# EAGLE design picopew (EAGLE 7.5.0)
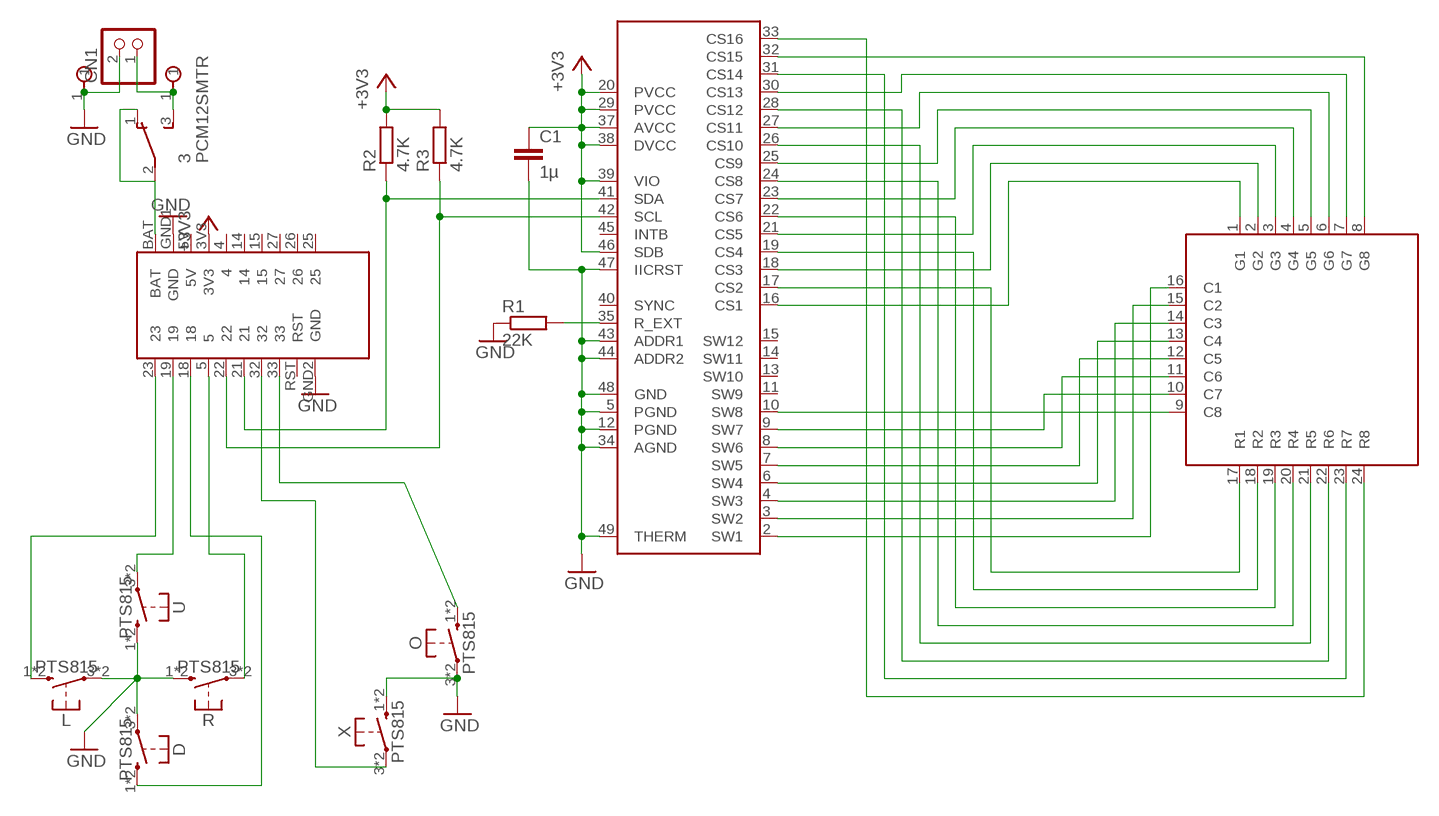
[diagram p0: schematic, sheet 1]

## Parts
1  KYX-788AHG  [KYX-788AHG]
2  TINYPICO  [TINYPICO]
3  PCM12SMTR  [MICROSLIDESWITCH]
4  SINGLEPAD  [SINGLEPAD]
5  SINGLEPAD  [SINGLEPAD]
C1  1µ  C-EUC0805  [C0805]
CN1  JST_2PIN-SMT-RA  [JST-PH-2-SMT-RA]
D  PTS815  [MICROPUSHBUTTON]
L  PTS815  [MICROPUSHBUTTON]
O  PTS815  [MICROPUSHBUTTON]
R  PTS815  [MICROPUSHBUTTON]
R1  22K  R-EU_R0805  [R0805]
R2  4.7K  R-EU_R0805  [R0805]
R3  4.7K  R-EU_R0805  [R0805]
U  PTS815  [MICROPUSHBUTTON]
U1  IS31FL3733-TQLS4  [TQFP48]
X  PTS815  [MICROPUSHBUTTON]

## Nets
+3V3: 2.3V3 C1.1 R2.2 R3.2 U1.20(PVCC) U1.29(PVCC) U1.37(AVCC) U1.38(DVCC) U1.39(VIO) U1.46(SDB)
GND: 2.GND1(GND) 2.GND2(GND) 5.1 C1.2 CN1.2 D.3(P) D.4(P) L.3(P) L.4(P) O.3(P) O.4(P) R1.1 R.1(S) R.2(S) U1.5(PGND) U1.12(PGND) U1.34(AGND) U1.43(ADDR1) U1.44(ADDR2) U1.47(IICRST) U1.48(GND) U1.49(THERM) U.1(S) U.2(S) X.1(S) X.2(S)
N$1: 1.16(C1) U1.2(SW1)
N$2: 1.15(C2) U1.3(SW2)
N$3: 1.14(C3) U1.4(SW3)
N$4: 1.13(C4) U1.6(SW4)
N$5: 1.12(C5) U1.7(SW5)
N$6: 1.11(C6) U1.8(SW6)
N$7: 1.10(C7) U1.9(SW7)
N$8: 1.9(C8) U1.10(SW8)
N$9: 1.1(G1) U1.16(CS1)
N$10: 1.17(R1) U1.17(CS2)
N$11: 1.2(G2) U1.18(CS3)
N$12: 1.18(R2) U1.19(CS4)
N$13: 1.3(G3) U1.21(CS5)
N$14: 1.19(R3) U1.22(CS6)
N$15: 1.4(G4) U1.23(CS7)
N$16: 1.20(R4) U1.24(CS8)
N$17: 1.5(G5) U1.25(CS9)
N$18: 1.21(R5) U1.26(CS10)
N$19: 1.6(G6) U1.27(CS11)
N$20: 1.22(R6) U1.28(CS12)
N$21: 1.7(G7) U1.30(CS13)
N$22: 1.23(R7) U1.31(CS14)
N$23: 1.8(G8) U1.32(CS15)
N$24: 1.24(R8) U1.33(CS16)
N$25: 2.21 R2.1 U1.41(SDA)
N$26: 2.22 R3.1 U1.42(SCL)
N$27: R1.2 U1.35(R_EXT)
N$28: 2.33 O.1(S) O.2(S)
N$29: 2.32 X.3(P) X.4(P)
N$30: 2.BAT 3.1(O) 3.2(P)
N$31: 3.3(S) 4.1 CN1.1
N$33: 2.5 R.3(P) R.4(P)
N$34: 2.18 D.1(S) D.2(S)
N$35: 2.19 U.3(P) U.4(P)
N$36: 2.23 L.1(S) L.2(S)
Unconnected: 2.4 2.14 2.15 2.25 2.26 2.27 2.RST U1.11(SW9) U1.13(SW10) U1.14(SW11) U1.15(SW12) U1.40(SYNC) U1.45(INTB)

## Power pins joined to a net without a drawn wire
5V: 2.5V

## Library data of the parts
1 = cwpackage:KYX-788AHG: 20mm bi-color LED matrix
2 = cwpackage:TINYPICO: TinyPICO
3 = cwpackage:PCM12SMTR: Ultraminiature Surface Mount Slide Switch
4 5 = cwpackage:SINGLEPAD: Single unlabeled through-hole pad
C1 = resistor:C-EU: CAPACITOR, European symbol
CN1 = cwpackage:JST_2PIN: JST 2-Pin Connectors of various flavors SMT-RA (S2B-PH-SM4) 4UConnector #17311
D L O R U X = cwpackage:PTS815: Tactile Switch Microminiature SMT
R1-R3 = resistor:R-EU_: RESISTOR, European symbol
U1 = cwpackage:IS31FL3733: 12×16 Dots Matrix LED Driver with individual auto breath function

## Board
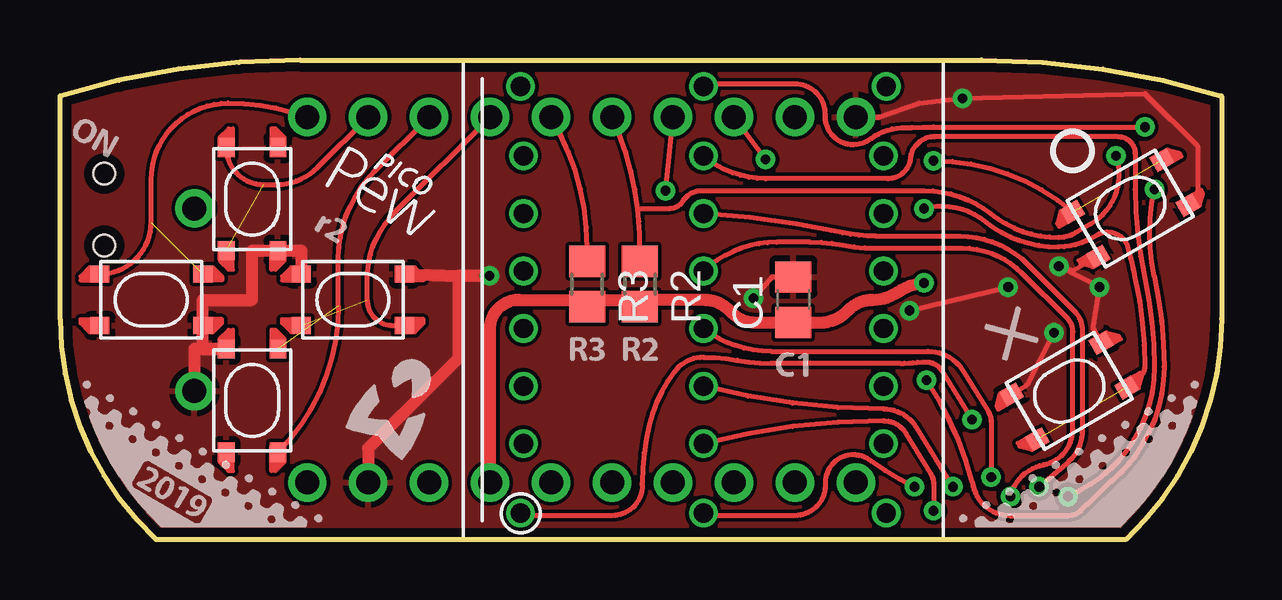
[diagram p1: board, top side]
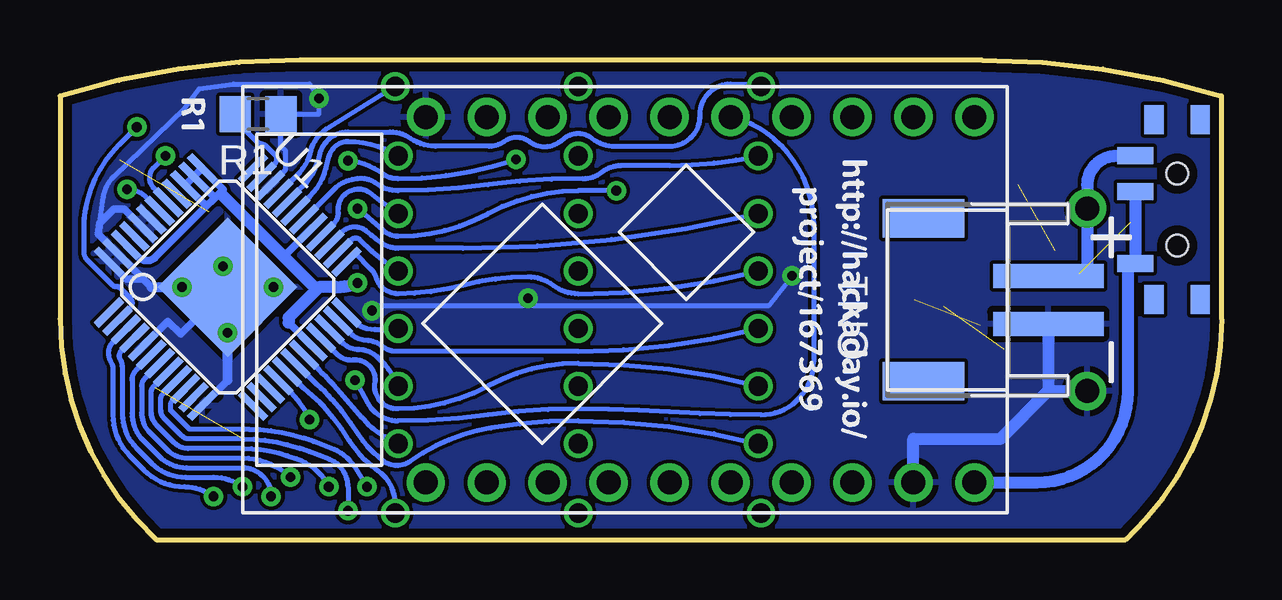
[diagram p2: board, bottom side, seen from below]

Size 48.4 x 20 mm. Coordinates in mm from the lower left corner, seen from the top.
Outline: 0,9.2 0,18.5 arc-17 10,20 38.4,20 arc-17 48.4,18.5 48.4,9.2 arc-47 44.4,0 4,0 arc-47 0,9.2
Copper layers (1*16): Top 0.035559375mm / dielectric 1.6mm / Bottom 0.035559375mm
Design rules "oshpark-2layer *": minimum track width 6mil, minimum drill 10mil, track to track 6mil, track to pad 6mil, pad to pad 6mil, via to via 6mil, smd to smd 0mil, copper to edge 15mil, drill to drill 6mil, minimum pad ring 5mil, minimum via ring 5mil, stop-mask expansion 2.5mil, vias tented up to drill 25mil, thermal gap 10mil

### Footprints (pad centres in the part's own frame; a part is rotated, then mirrored left to right if it is on the bottom)
KYX-788AHG = drill 0.8 pad 1.1: 1 -7.62,-8.9; 2 -7.5,-6; 3 -7.5,-3.6; 4 -7.5,-1.2; 5 -7.5,1.2; 6 -7.5,3.6; 7 -7.5,6; 8 -7.62,8.9; 9 0,-8.9; 10 0,-6; 11 0,-3.6; 12 0,-1.2; 13 0,1.2; 14 0,3.6; 15 0,6; 16 0,8.9; 17 7.62,-8.9; 18 7.5,-6; 19 7.5,-3.6; 20 7.5,-1.2; 21 7.5,1.2; 22 7.5,3.6; 23 7.5,6; 24 7.62,8.9
TINYPICO = drill 1 pad 1.6: 3V3 7.62,15.24; 4 10.16,15.24; 5 7.62,0; 5V 5.08,15.24; 14 12.7,15.24; 15 15.24,15.24; 18 5.08,0; 19 2.54,0; 21 12.7,0; 22 10.16,0; 23 0,0; 25 22.86,15.24; 26 20.32,15.24; 27 17.78,15.24; 32 15.24,0; 33 17.78,0; BAT 0,15.24; GND1 2.54,15.24; GND2 22.86,0; RST 20.32,0
MICROSLIDESWITCH = smd 0.7 x 1.5: 1 -2.25,1.75; 2 0.75,1.75; 3 2.25,1.75 | smd 1.2 x 0.8: CASE@1 -3.75,0.965; CASE@2 3.75,0.965; CASE@3 -3.75,-0.965; CASE@4 3.75,-0.965 | hole 0.9: -1.5,0; 1.5,0
SINGLEPAD = drill 1 pad 1.6: 1 0,0
C0805 = smd 1.3 x 1.5: 1 -0.95,0; 2 0.95,0
JST-PH-2-SMT-RA = smd 1 x 4.6: 1 1,-3.7; 2 -1,-3.7 | smd 1.6 x 3.4: NC1 -3.4,1.5; NC2 3.4,1.5
MICROPUSHBUTTON = smd 0.8 x 0.7: 1 -2.15,1.075; 2 2.15,1.075; 3 -2.15,-1.075; 4 2.15,-1.075
R0805 = smd 1.3 x 1.5: 1 -0.95,0; 2 0.95,0
TQFP48 = smd 0.3 x 1.5: 1 -2.75,-4.25; 2 -2.25,-4.25; 3 -1.75,-4.25; 4 -1.25,-4.25; 5 -0.75,-4.25; 6 -0.25,-4.25; 7 0.25,-4.25; 8 0.75,-4.25; 9 1.25,-4.25; 10 1.75,-4.25; 11 2.25,-4.25; 12 2.75,-4.25; 25 2.75,4.25; 26 2.25,4.25; 27 1.75,4.25; 28 1.25,4.25; 29 0.75,4.25; 30 0.25,4.25; 31 -0.25,4.25; 32 -0.75,4.25; 33 -1.25,4.25; 34 -1.75,4.25; 35 -2.25,4.25; 36 -2.75,4.25 | smd 1.5 x 0.3: 13 4.25,-2.75; 14 4.25,-2.25; 15 4.25,-1.75; 16 4.25,-1.25; 17 4.25,-0.75; 18 4.25,-0.25; 19 4.25,0.25; 20 4.25,0.75; 21 4.25,1.25; 22 4.25,1.75; 23 4.25,2.25; 24 4.25,2.75; 37 -4.25,2.75; 38 -4.25,2.25; 39 -4.25,1.75; 40 -4.25,1.25; 41 -4.25,0.75; 42 -4.25,0.25; 43 -4.25,-0.25; 44 -4.25,-0.75; 45 -4.25,-1.25; 46 -4.25,-1.75; 47 -4.25,-2.25; 48 -4.25,-2.75 | smd 4.11 x 4.11: 49 0,0

### Placement (x,y rotation side)
1  26.81,10 0 top
2  10.3,17.62 180 bottom
3  1.85,13.76 90 bottom
4  5.6,13.81 0 top
5  5.6,6.19 0 top
C1  30.56,10 90 top
CN1  10.92,10 90 bottom
D  8,5.8 270 top
L  3.81,10 0 top
O  44.59,13.81 30 top
R  12.21,10 0 top
R1  40.15,17.75 180 bottom
R2  24.16,10.66 270 top
R3  21.96,10.66 270 top
U  8,14.2 270 top
U1  41.41,10.53 315 bottom
U$1  [PICOPEW-O]  42.19,16.21 30 top
U$2  [PICOPEW-CORNER-L]  0,0 0 top
U$3  [PICOPEW-X]  39.65,8.59 30 top
U$4  [PLUS]  4.6,12.6 270 bottom
U$5  [PICOPEW]  13,13.6 330 top
U$6  [CHAR114]  10.54,12.92 330 top
U$7  [CWLOGO-4]  14,5.6 330 top
U$8  [PICOPEW-CORNER-R]  48.4,0 0 top
U$9  [CHAR050]  10.98,12.67 330 top
U$10  [CHAR079]  0.36,16.84 330 top
U$11  [CHAR078]  1.24,16.34 330 top
U$12  [MINUS]  4.6,7.4 270 bottom
U$14  [CHAR082]  43.35,18.45 270 bottom
U$15  [CHAR050]  3.15,2.3 330 top
U$16  [CHAR048]  3.81,1.92 330 top
U$17  [CHAR049]  4.47,1.54 330 top
U$18  [CHAR057]  5.13,1.15 330 top
U$19  [CHAR049]  43.35,17.62 270 bottom
U$20  [CHAR082]  23.4,7.45 0 top
U$21  [CHAR050]  24.23,7.45 0 top
U$22  [CHAR082]  21.19,7.45 0 top
U$23  [CHAR051]  22.02,7.45 0 top
U$24  [CHAR067]  29.82,6.8 0 top
U$25  [CHAR049]  30.66,6.8 0 top
U$26  [CHAR049]  17.6,9.92 270 bottom
U$27  [CHAR054]  17.6,9.15 270 bottom
U$28  [CHAR055]  17.6,8.39 270 bottom
U$29  [CHAR051]  17.6,7.62 270 bottom
U$30  [CHAR054]  17.6,6.86 270 bottom
U$31  [CHAR057]  17.6,6.09 270 bottom
U$52  [CHAR104]  15.8,15.85 270 bottom
U$53  [CHAR116]  15.8,15.04 270 bottom
U$54  [CHAR116]  15.8,14.55 270 bottom
U$55  [CHAR112]  15.8,14.06 270 bottom
U$56  [CHAR058]  15.8,13.22 270 bottom
U$57  [CHAR047]  15.8,12.89 270 bottom
U$58  [CHAR047]  15.8,12.46 270 bottom
U$59  [CHAR104]  15.8,12.02 270 bottom
U$60  [CHAR097]  15.8,11.21 270 bottom
U$61  [CHAR099]  15.8,10.48 270 bottom
U$62  [CHAR107]  15.8,9.87 270 bottom
U$63  [CHAR097]  15.8,9.12 270 bottom
U$64  [CHAR100]  15.8,8.39 270 bottom
U$65  [CHAR097]  15.8,7.56 270 bottom
U$66  [CHAR121]  15.8,6.84 270 bottom
U$67  [CHAR046]  15.8,6.12 270 bottom
U$68  [CHAR105]  15.8,5.79 270 bottom
U$69  [CHAR111]  15.8,5.43 270 bottom
U$70  [CHAR047]  15.8,4.63 270 bottom
U$71  [CHAR112]  17.6,14.7 270 bottom
U$72  [CHAR114]  17.6,13.87 270 bottom
U$73  [CHAR111]  17.6,13.36 270 bottom
U$74  [CHAR106]  17.6,12.56 270 bottom
U$75  [CHAR101]  17.6,12.18 270 bottom
U$76  [CHAR099]  17.6,11.46 270 bottom
U$77  [CHAR116]  17.6,10.84 270 bottom
U$78  [CHAR047]  17.6,10.35 270 bottom
X  42.05,6.19 30 top

### Tracks (layer width: path | path; a pad name or v marks a point on that pad's centre or on a via)
+3V3  (via drill 0.4 pad 0.81)
  Top 0.203: R3.2 21.96,10 | 24.16,10 R2.2
  Top 0.508: 2.3V3 17.92,8.8 arc-90 19.12,10 21.96,10 24.16,10 26.87,10 arc-45 27.86,9.59 27.99,9.46 arc45 28.98,9.05 C1.1 31.57,9.05 arc45 32.74,9.46 32.87,9.59 arc-45 33.86,10 arc33 34.9,10.31 arc-28 v36,10.7
  Bottom 0.305: 38.88,9.05 U1.20 | U1.29 39.08,11.8 | U1.46 45.13,11.77 arc-90 44.43,11.77 42.3,13.9 | 42.3,13.9 42,14.2 | 42,14.2 41.7,14.5 | 41.7,14.5 41.61,14.59 41.6,14.59 U1.37 U1.39 42.31,13.9 42.3,13.9 | U1.38 42,14.3 42,14.2 | 41.6,14.32 41.7,14.5
  Bottom 0.508: 37.7,10.43 38.88,9.26 38.88,9.05 | 37.7,10.43 39.08,11.8 41.6,14.32 | v36,10.7 arc22 36.87,10.53 37.61,10.53 37.7,10.43
GND  (via drill 0.4 pad 0.81)
  Top 0.203: O.3 42.2,11.2 v41.62,11.4 v43.32,10.53 43.05,8.85 X.2 | v35.4,9.55 v39.51,10.53 | 2.GND2 34.11,17.62 35.8,18.2 v37.6,18.4 45.2,18.6 47.4,16.4 47.4,14.37 O.4 | X.1 40.3,6.45 v41.41,8.62 | C1.2 29.66,10.95 v28.9,10.07
  Top 0.508: v17.9,11 16.6,11 | 16.6,11 16.6,7.56 12.84,3.8 2.GND1 | R.2 16.6,11 | 5.1 5.6,7.95 D.3 5.96,7.95 L.4 5.96,10 8,10 8,12.05 U.2 10.05,12.05 R.1
  Bottom 0.203: 43.89,10.53 U1.49 | 42.48,10.53 U1.49 | 41.77,10.53 U1.49 | v41.62,11.4 U1.49 | v17.9,11 18.87,9.75 28.7,9.75 v28.9,10.07 29.1,9.75 35.2,9.75 v35.4,9.55 | v39.51,10.53 U1.49 | v43.32,10.53 U1.49 | U1.34 39,15.42 39,16.2 39.2,16.39 R1.1 37.6,17.75 v37.6,18.4 38,19 41.18,19 42.6,18.8 43.2,18 46.15,15.15 arc-38 46.59,14.27 46.74,13.19
  Bottom 0.305: U1.12 41.41,6.64 | v41.41,8.62 U1.49 43.37,8.57 43.9,9.1 U1.5 | 44.93,10.87 U1.47 46.8,12.73 46.74,13.19 46.15,13.78 45.73,13.78 U1.44 | 44.93,10.87 44.6,10.53 | U1.48 45.64,10.87 44.93,10.87
  Bottom 0.406: 41.41,6.64 U1.49 44.6,10.53
  Bottom 0.508: 2.GND1 12.84,4.2 9.2,4.2 7.22,6.19 | CN1.2 7.22,6.19 | 7.22,6.19 5.1
  pour Bottom: 10,19.94 38.4,19.94 arc-17 48.6,18.5 48.6,9.2 arc-47 44.4,-0.06 4,-0.06 arc-47 -0.2,9.2 -0.2,18.5 arc-17
  pour Top: 48.6,18.5 48.6,9.2 arc-47 44.4,-0.06 4,-0.06 arc-47 -0.1,9.2 -0.1,18.5 arc-17 10,20.04 38.4,20.04 arc-17
N$1  (via drill 0.4 pad 0.81)
  Top 0.203: v45.2,17.2 36.4,17.2 arc3 35.06,17.17 arc33 33.79,16.73 33.72,16.68 arc-125 31.89,17.62 31.89,17.73 arc90 30.62,19 27.06,19 1.16
  Bottom 0.203: U1.2 45.48,9.65 arc-90 45.48,10.08 45.9,10.5 | 46.2,10.6 47.28,11.68 arc45 47.4,11.97 47.4,12.93 arc45 45.94,16.46 v45.2,17.2 | 45.9,10.5 46.05,10.55 | 46.05,10.55 46.2,10.6 | 45.9,10.5 arc-53 46.05,10.55 | 46.05,10.55 arc53 46.2,10.6
N$2  (via drill 0.4 pad 0.81)
  Top 0.203: 1.15 arc40 29.4,15.05 34.5,15.05 arc85 35.43,15.89 arc-85 36.43,16.8 44.1,16.8 arc-90 44.8,16.1 44.8,14.6 arc12 45.2,10.9 arc-12 45.6,7.2 arc-67 v42,1.8
  Bottom 0.203: U1.3 46.2,8.22 arc-48 46.37,7.78 arc-28 46.23,7.32 arc31 46.2,7.2 46.2,5.19 arc-45 45.5,3.5 44.9,2.9 arc-45 43.21,2.2 arc37 v42,1.8
N$3  (via drill 0.4 pad 0.81)
  Top 0.203: 1.14 1.14 arc-9 32.6,12.8 arc12 34,12.65 37.49,12.65 arc-45 40.32,11.48 42.25,9.55 arc-45 42.6,8.7 42.6,4.6 arc-50 41.92,3.14 v40.8,2.2
  Bottom 0.203: U1.4 45.85,7.86 arc-76 45.89,7.53 arc31 45.8,7.2 45.8,5.23 arc-45 45.21,3.81 44.59,3.19 arc-45 43.17,2.6 42,2.6 arc37 v40.8,2.2
N$4  (via drill 0.4 pad 0.81)
  Top 0.203: 1.13 arc-43 29.86,12.4 31.26,12.4 arc-10 32.63,12.28 arc10 34,12.15 37.6,12.15 arc-45 40.08,11.12 41.97,9.23 arc-45 42.2,8.67 42.2,4.6 arc-79 40.99,3.12 arc65 v39.6,1.8
  Bottom 0.203: U1.6 45.22,7.07 arc-45 45.4,6.65 45.4,5.26 arc-45 44.93,4.13 44.27,3.47 arc-45 43.14,3 40.8,3 arc90 v39.6,1.8
N$5  (via drill 0.4 pad 0.81)
  Top 0.203: v38.8,2.6 38.8,4.92 arc32 38.69,5.31 37.62,7.04 arc58 36.17,7.85 29.63,7.85 arc-37 1.12
  Bottom 0.203: U1.7 44.87,6.72 arc-45 45,6.41 45,5.3 arc-45 44.65,4.45 43.95,3.75 arc-45 43.1,3.4 40.8,3.4 arc44 v38.8,2.6
N$6  (via drill 0.4 pad 0.81)
  Top 0.203: 1.11 arc14 34.31,5.45 arc-58 35.67,4.69 v37.2,2.2
  Bottom 0.203: U1.8 44.51,6.37 arc-45 44.6,6.16 44.6,5.33 arc-45 44.37,4.77 43.63,4.03 arc-45 43.07,3.8 40.8,3.8 arc18 38.93,3.5 38.54,3.37 arc45 v37.2,2.2
N$7  (via drill 0.4 pad 0.81)
  Top 0.203: 1.10 arc-14 34.31,4.95 34.32,4.95 arc-59 35.25,4.43 36.28,2.74 arc-31 36.4,2.32 v36.4,1.2
  Bottom 0.203: U1.9 44.16,6.02 arc-45 44.2,5.92 44.2,5.37 arc-45 44.08,5.08 43.32,4.32 arc-45 43.03,4.2 40.8,4.2 arc18 38.46,3.82 | 38.46,3.82 38.4,3.8 | v36.4,1.2 36.4,2.2 arc-68 37.17,3.34 arc-4 38.46,3.82
N$8  (via drill 0.4 pad 0.81)
  Top 0.203: 1.9 27.06,1 30.62,1 arc90 31.89,2.27 31.89,2.38 arc-125 33.72,3.32 33.79,3.27 arc9 v35.6,2.2
  Bottom 0.203: U1.10 43.8,5.67 43.8,5.4 43,4.6 40.53,4.6 arc18 38.26,4.23 arc4 37,3.77 arc36 36.12,3.03 v35.6,2.2
N$9  (via drill 0.4 pad 0.81)
  Top 0.203: 1.1 19.44,1 23,1 arc90 24.27,2.27 24.27,2.38 arc-13 24.56,4.8 arc-24 25.6,7 arc-53 26.81,7.6 arc-10 28.22,7.47 arc10 29.63,7.35 35,7.35 arc5 35.55,7.38 arc-5 36.1,7.4 arc-58 36.74,7.04 v38,5
  Bottom 0.203: U1.16 38.8,6.15 arc20 v38,5
N$10
  Bottom 0.203: U1.17 38.4,6.45 arc-7 37.89,6 arc11 37.39,5.53 arc8 36.34,4.12 arc-22 35.13,2.85 arc54 34.43,1.48 1.17
N$11
  Bottom 0.203: U1.18 38,6.76 arc-3 37.52,6.3 arc7 37.05,5.83 arc8 35.95,4.37 arc-22 34.87,3.23 arc-66 33.79,3.27 arc26 30.43,4.65 arc9 26.81,4.95 arc14 1.2
N$12
  Bottom 0.203: U1.19 37.6,7.07 arc1 37.15,6.6 arc3 36.71,6.12 35.8,5.08 arc-26 1.18
N$13
  Bottom 0.203: U1.21 36.82,7.7 arc-52 36.2,7.48 arc46 35.56,7.29 arc58 35.28,6.55 35.28,6.54 arc-98 34.34,5.45 34.31,5.45 arc-28 30.56,6.4 arc28 26.81,7.35 arc14 1.3
N$14
  Bottom 0.203: U1.22 36.61,8.2 arc-45 35.94,7.92 arc39 35.25,7.67 arc27 1.19
N$15
  Bottom 0.203: U1.23 36.3,8.6 arc-43 35.63,8.3 arc37 34.94,8.04 arc-40 34.42,7.85 26.81,7.85 arc-14 1.4
N$16
  Bottom 0.203: U1.24 36,9 arc-36 35.6,8.8 arc-17 1.20
N$17
  Bottom 0.203: 36.16,11.9 U1.25 36.11,11.95 35.43,11.27 arc29 35.23,10.93 arc-74 34.32,10.25 34.31,10.25 arc-15 31.61,10.6 arc15 28.9,10.95 arc37 27.86,10.6 arc-37 26.81,10.25 arc-14 1.5
N$18
  Bottom 0.203: U1.26 36.26,12.51 arc90 35.91,12.51 arc-11 1.21
N$19
  Bottom 0.203: U1.27 36.65,12.82 arc86 35.63,12.86 arc-5 35.03,12.38 arc-36 34.31,12.15 31.6,12.15 arc-13 1.6
N$20
  Bottom 0.203: U1.28 36.98,13.2 arc-45 36.8,13.63 36.8,13.8 arc79 36.16,14.58 | 36.16,14.58 | 36.16,14.58 36.09,14.6 arc49 35.49,14.46 arc-3 1.22
N$21
  Bottom 0.203: 1.7 arc12 23,15.6 25.02,15.6 arc-38 25.82,15.32 arc38 26.61,15.05 arc-8 30.56,14.8 arc8 34.31,14.55 arc17 34.78,14.62 arc20 35.2,14.84 arc-49 36.09,15.05 36.24,15.02 arc-34 36.96,14.63 U1.30
N$22
  Bottom 0.203: U1.31 37.97,14.33 arc-30 37.32,15.45 37.17,16.01 arc75 36.4,16.6 arc32 1.23
N$23
  Bottom 0.203: 1.8 19.33,19 20.46,19 arc-90 21.73,17.73 21.73,17.67 arc90 23,16.4 25.28,16.4 arc38 26.24,16.73 arc-76 27.38,16.73 27.54,16.61 arc75 28.85,16.59 arc-71 29.88,16.61 29.91,16.59 arc35 30.52,16.4 32.76,16.4 arc35 33.79,16.73 arc-35 34.65,17 36.4,17 arc-75 37.56,16.11 37.63,15.85 arc30 38.28,14.73 U1.32
N$24
  Bottom 0.203: U1.33 38.56,15.16 arc-30 37.95,16.21 arc46 37.19,17.19 1.24
N$25  (via drill 0.4 pad 0.81)
  Top 0.203: v44,16 arc-79 42.95,13.17 42.28,12.79 42.27,12.78 arc-30 41.6,12.6 arc-38 38.8,13.57 arc38 36,14.55 26.72,14.55 arc59 25.95,14.11 arc-59 25.42,13.81 24.07,13.81 | R2.1 24.16,12.2 arc6 24.07,13.81 | 24.07,13.81 arc19 2.21
  Bottom 0.203: U1.41 44.49,14.66 arc90 44.49,15.51 v44,16
N$26  (via drill 0.4 pad 0.81)
  Top 0.203: v45.6,14.6 arc25 45.59,10.98 arc-12 46,7.2 arc-46 44.09,2.7 42.55,1.22 arc-44 42,1 39.6,1 arc-76 38.05,2.21 38,2.4 arc20 v36.1,6.65 | R3.1 21.96,12.2 arc31 2.22
  Bottom 0.203: U1.42 44.8,14.27 arc-45 v45.6,14.6 | 2.22 arc28 18.68,16.73 arc49 17,13.08 17,7.4 arc90 19.2,5.2 arc4 23.01,5.33 arc-4 26.81,5.45 arc-8 30.56,5.2 arc8 34.31,4.95 arc61 35.59,5.71 v36.1,6.65
N$27
  Bottom 0.203: U1.35 39.44,15.69 arc-90 39.44,16.04 39.8,16.4 arc-37 40,16.5 arc37 40.2,16.6 41.09,17.5 R1.2
N$28  (via drill 0.4 pad 0.81)  (1 unrouted)
  Top 0.203: 2.33 v29.4,15.85 | v36.4,15.8 arc-40 O.1
  Bottom 0.203: v29.4,15.85 arc19 34.31,15.05 arc13 34.62,15.09 arc24 34.91,15.22 arc-33 v36.4,15.8
N$29  (via drill 0.4 pad 0.81)  (1 unrouted)
  Top 0.203: 2.32 v25.22,14.55 | X.4 45,6.8 arc53 45.2,7.2 arc12 44.81,10.81 arc1 44.5,12.16 arc106 43.22,12.71 42.98,12.57 arc-30 41.6,12.2 arc-38 38.55,13.26 arc53 v36,13.8
  Bottom 0.203: v25.22,14.55 26.81,14.55 arc-28 30.56,13.6 arc28 34.31,12.65 arc41 34.93,12.88 v36,13.8
N$30
  Bottom 0.508: 3.2 3.1 3.9,11.49 3.9,6.18 arc90 7.7,2.38 2.BAT
N$31
  Bottom 0.508: CN1.1 5.6,11 4.1 5.6,14.79 arc90 4.4,15.99 4.2,15.99 3.3
N$33  (1 unrouted)
  Top 0.203: R.4 13.87,8.93 arc-90 12.8,10 12.8,10.84 arc-45 13.97,13.67 2.5
N$34  (1 unrouted)
  Top 0.203: D.2 arc45 11.6,9.73 11.6,11.69 arc-45 13.12,15.36 2.18
N$35  (1 unrouted)
  Top 0.203: U.3 arc90 8.48,14.8 9,14.8 arc45 10.74,15.52 2.19
N$36  (1 unrouted)
  Top 0.203: L.1 arc90 3.8,13.22 3.8,15 arc-90 7,18.2 arc-20 2.23